# EAGLE design Lasers_Drivers_Design_Pingu_X1_pingu (EAGLE 9.6.2)
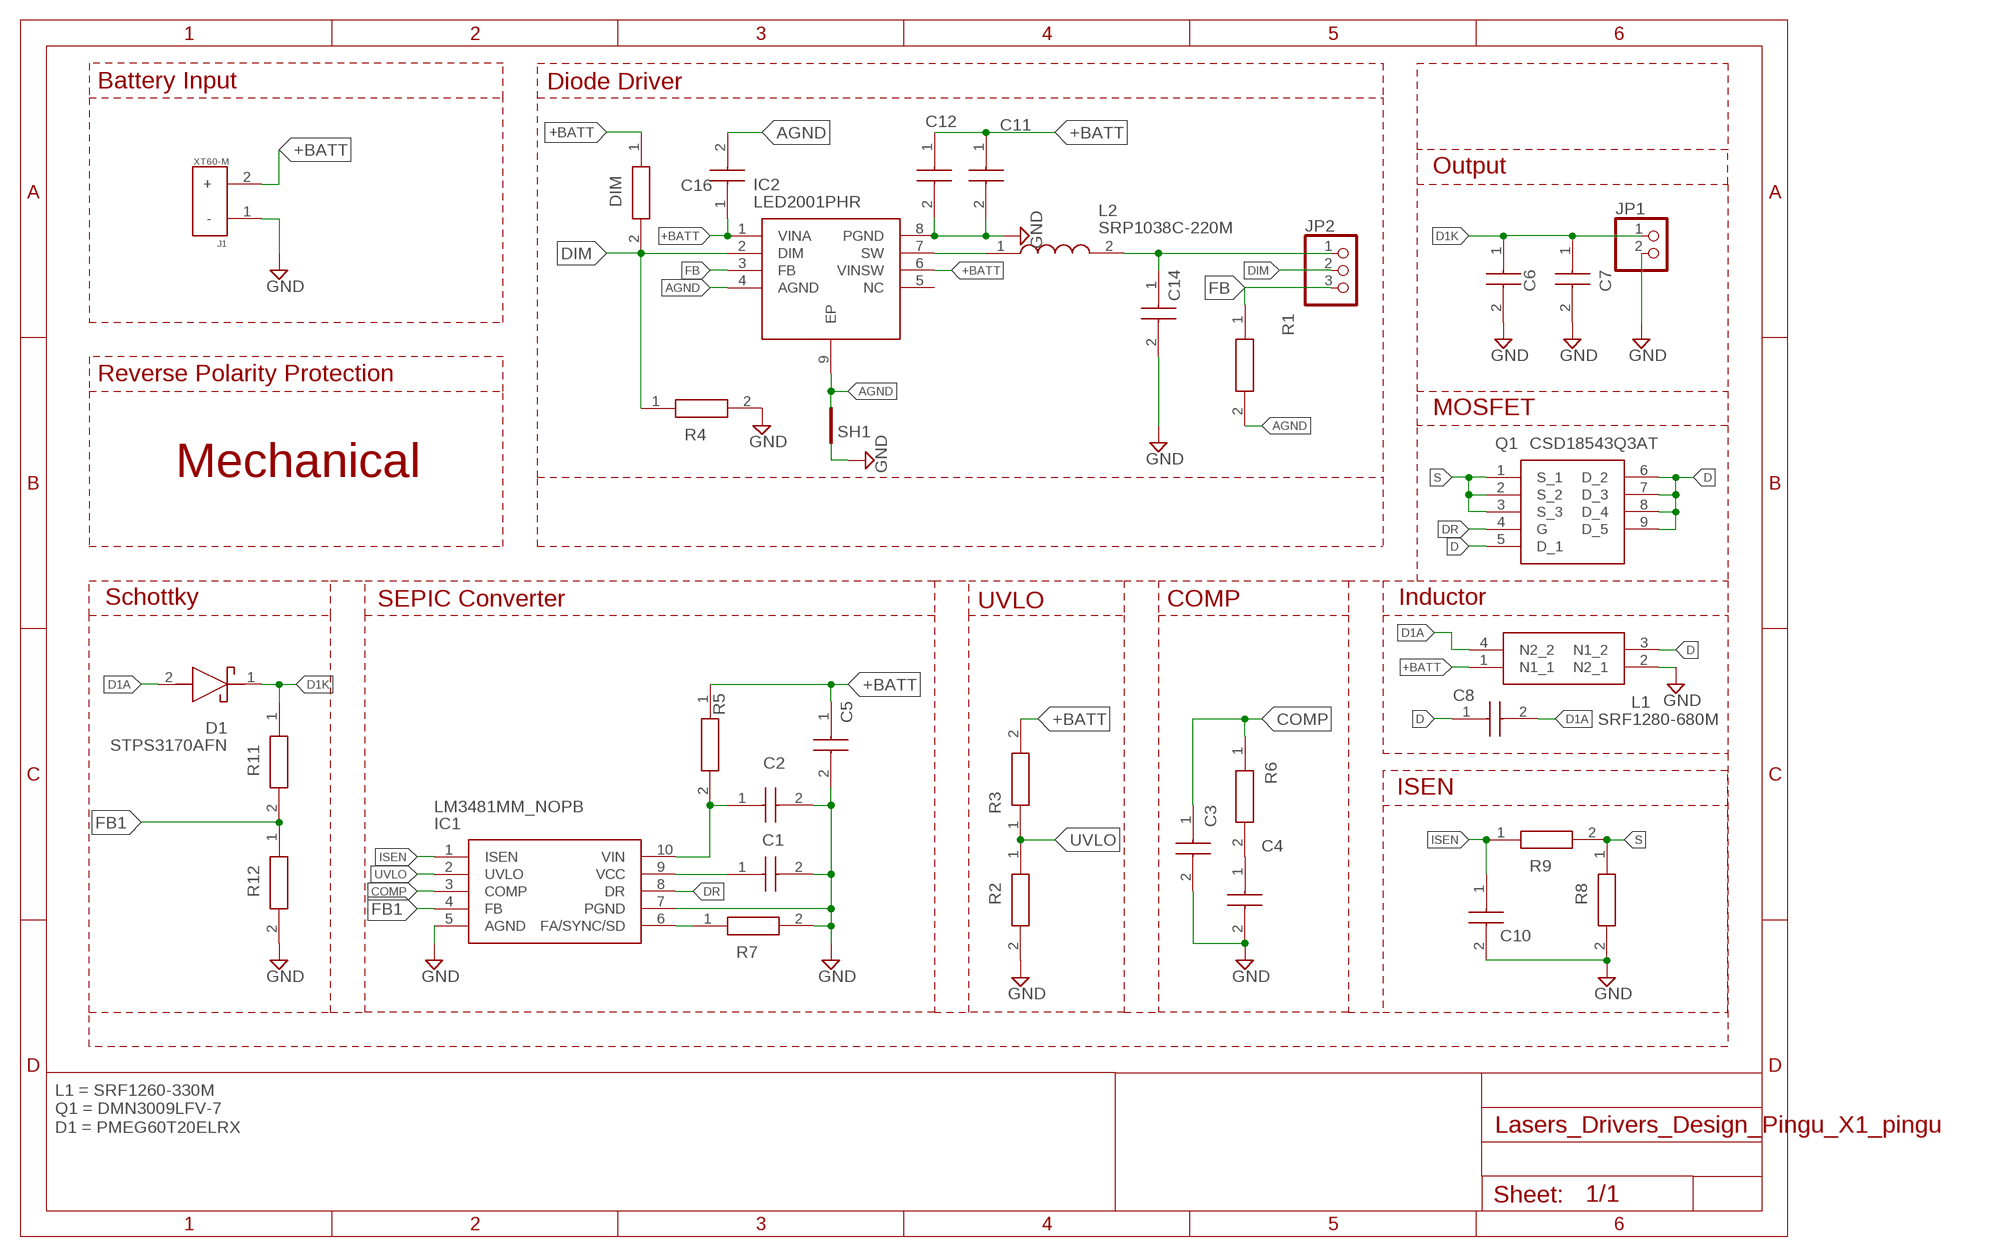
[diagram p0: schematic, sheet 1]

## Parts
C1  GCM0335C1H8R0DA16J  [CAPC0603X33N]
C2  GCM0335C1H8R0DA16J  [CAPC0603X33N]
C3  GCM0335C1H8R0DA16J  [CAPC0603X33N]
C4  GCM0335C1H8R0DA16J  [CAPC0603X33N]
C5  C1206C475K5RACTU  [CAPC3216X180N]
C6  C1206C475K5RACTU  [CAPC3216X180N]
C7  C1206C475K5RACTU  [CAPC3216X180N]
C8  C1206C475K5RACTU  [CAPC3216X180N]
C10  GCM0335C1H8R0DA16J  [CAPC0603X33N]
C11  GCM0335C1H8R0DA16J  [CAPC0603X33N]
C12  GCM0335C1H8R0DA16J  [CAPC0603X33N]
C14  C1206C475K5RACTU  [CAPC3216X180N]
C16  C1206C475K5RACTU  [CAPC3216X180N]
D1  STPS3170AFN  [SODFL5226X110N]
DIM  ERJ-3BWFR100V  [RESC1608X55N]
IC1  LM3481MM_NOPB  [SOP50P490X110-10N]
IC2  LED2001PHR  [SOIC127P600X170-9N]
J1  XT60-M  [AMASS_XT60-M]
JP1  PINHD-1X2  [1X02]
JP2  PINHD-1X3  [1X03]
L1  SRF1280-680M  [SRF1280680M]
L2  SRP1038C-220M  [INDPM110100X420N]
Q1  CSD18543Q3AT  [CSD18543Q3AT]
R1  ERJ-3BWFR100V  [RESC1608X55N]
R2  ERJ-3BWFR100V  [RESC1608X55N]
R3  ERJ-3BWFR100V  [RESC1608X55N]
R4  ERJ-3BWFR100V  [RESC1608X55N]
R5  ERJ-3BWFR100V  [RESC1608X55N]
R6  ERJ-3BWFR100V  [RESC1608X55N]
R7  ERJ-3BWFR100V  [RESC1608X55N]
R8  ERJ-3BWFR100V  [RESC1608X55N]
R9  ERJ-3BWFR100V  [RESC1608X55N]
R11  ERJ-3BWFR100V  [RESC1608X55N]
R12  ERJ-3BWFR100V  [RESC1608X55N]
SH1  SHORTT5  [SHORT_TOP-50]

## Nets
+BATT: C5.1 C11.1 C12.1 C16.1 DIM.1 IC2.1(VINA) IC2.6(VINSW) J1.2(+) L1.1(N1_1) R3.2 R5.1
AGND: C16.2 IC2.4(AGND) IC2.9(EP) R1.2 SH1.2
COMP: C3.1 IC1.3(COMP) R6.1
D: C8.1 L1.3(N1_2) Q1.5(D_1) Q1.6(D_2) Q1.7(D_3) Q1.8(D_4) Q1.9(D_5)
D1A: C8.2 D1.2(A) L1.4(N2_2)
D1K: C6.1 C7.1 D1.1(K) JP1.1 R11.1
DIM: DIM.2 IC2.2(DIM) JP2.2 R4.1
DR: IC1.8(DR) Q1.4(G)
FB: IC2.3(FB) JP2.3 R1.1
FB1: IC1.4(FB) R11.2 R12.1
GND: C1.2 C2.2 C3.2 C4.2 C5.2 C6.2 C7.2 C10.2 C11.2 C12.2 C14.2 IC1.5(AGND) IC1.7(PGND) IC2.8(PGND) J1.1(-) JP1.2 L1.2(N2_1) R2.2 R4.2 R7.2 R8.2 R12.2 SH1.1
ISEN: C10.1 IC1.1(ISEN) R9.1
N$1: C1.1 IC1.9(VCC)
N$2: C4.1 R6.2
N$7: IC2.7(SW) L2.1
N$8: IC1.6(FA/SYNC/SD) R7.1
N$9: C2.1 IC1.10(VIN) R5.2
N$10: C14.1 JP2.1 L2.2
S: Q1.1(S_1) Q1.2(S_2) Q1.3(S_3) R8.1 R9.2
UVLO: IC1.2(UVLO) R2.1 R3.1
Unconnected: IC2.5(NC)

## Notes on the sheet
- Battery Input | Diode Driver
- Output
- Reverse Polarity Protection
- MOSFET
- Mechanical
- Schottky | SEPIC Converter | UVLO | COMP | Inductor
- ISEN
- D1 = PMEG60T20ELRX
- L1 = SRF1260-330M | Q1 = DMN3009LFV-7

## Library data of the parts
C1-C4 C10-C12 = SamacSys_Parts:GCM0335C1H8R0DA16J: Capacitor GCM03 L=0.6mm W=0.3mm T=0.3mm Source: Datasheet <https://psearch.en.murata.com/capacitor/product/GCM0335C1H8R0DA16#.html>; ARROW_PART_NUMBER: GCM0335C1H8R0DA16J; DESCRIPTION: Capacitor GCM03 L=0.6mm W=0.3mm T=0.3mm; HEIGHT: 0.33mm; MANUFACTURER_NAME: Murata Electronics; MANUFACTURER_PART_NUMBER: GCM0335C1H8R0DA16J; MOUSER_PART_NUMBER: 81-GCM0335C1H8R0DA6J; MOUSER_PRICE-STOCK: https://www.mouser.co.uk/ProductDetail/Murata-Electronics/GCM0335C1H8R0DA16J?qs=5aG0NVq1C4xZsh9jmVEFyg%3D%3D
C5-C8 C14 C16 = SamacSys_Parts:C1206C475K5RACTU: Kemet 1206 C 4.7uF Ceramic Multilayer Capacitor, 50 V dc, +125C, X7R Dielectric, +/-10% Source: Datasheet <https://search.kemet.com/component-edge/download/specsheet/C1206C475K5RACTU.pdf>; ARROW_PART_NUMBER: C1206C475K5RACTU; ARROW_PRICE-STOCK: https://www.arrow.com/en/products/c1206c475k5ractu/kemet-corporation; DESCRIPTION: Kemet 1206 C 4.7uF Ceramic Multilayer Capacitor, 50 V dc, +125C, X7R Dielectric, +/-10%; HEIGHT: 1.8mm; MANUFACTURER_NAME: Kemet; MANUFACTURER_PART_NUMBER: C1206C475K5RACTU; MOUSER_PART_NUMBER: 80-C1206C475K5R; MOUSER_PRICE-STOCK: https://www.mouser.co.uk/ProductDetail/KEMET/C1206C475K5RACTU?qs=eTOzTKnOMhYOc4dq0S20Rg%3D%3D
D1 = SamacSys_Parts:STPS3170AFN: Schottky Diodes & Rectifiers DFD THYR TRIAC & RECTIFIER Source: Datasheet <https://www.st.com/resource/en/datasheet/stps3170.pdf>; ARROW_PART_NUMBER: STPS3170AFN; DESCRIPTION: Schottky Diodes & Rectifiers DFD THYR TRIAC & RECTIFIER; HEIGHT: 1.1mm; MANUFACTURER_NAME: STMicroelectronics; MANUFACTURER_PART_NUMBER: STPS3170AFN; MOUSER_PART_NUMBER: 511-STPS3170AFN; MOUSER_PRICE-STOCK: https://www.mouser.co.uk/ProductDetail/STMicroelectronics/STPS3170AFN?qs=Cb2nCFKsA8pM4tLC7PCfCQ%3D%3D
DIM R1-R9 R11 R12 = SamacSys_Parts:ERJ-3BWFR100V: Panasonic ERJ3B Series Thick Film Fixed Resistor 0603 Case 100m +/-1% 0.25W +/-150ppm/C Source: Datasheet <http://docs-emea.rs-online.com/webdocs/13ba/0900766b813ba21b.pdf>; ARROW_PART_NUMBER: ERJ-3BWFR100V; ARROW_PRICE-STOCK: https://www.arrow.com/en/products/erj3bwfr100v/panasonic; DESCRIPTION: Panasonic ERJ3B Series Thick Film Fixed Resistor 0603 Case 100m +/-1% 0.25W +/-150ppm/C; HEIGHT: 0.55mm; MANUFACTURER_NAME: Panasonic; MANUFACTURER_PART_NUMBER: ERJ-3BWFR100V; MOUSER_PART_NUMBER: 667-ERJ-3BWFR100V; MOUSER_PRICE-STOCK: https://www.mouser.co.uk/ProductDetail/Panasonic/ERJ-3BWFR100V?qs=ob%252BdNz2%252BYEjAMRvh2K5PaA%3D%3D
IC1 = SamacSys_Parts:LM3481MM_NOPB: Texas Instruments,LM3481MM/NOPB,IC,DC-DC Texas Instruments LM3481MM/NOPB, DC-DC Controller, 1A, 48 V, Step Up, 1 MHz, 10-Pin, VSSOP Source: Datasheet <http://www.ti.com/general/docs/lit/getliterature.tsp?genericPartNumber=lm3481&fileType=pdf>; ARROW_PART_NUMBER: LM3481MM/NOPB; ARROW_PRICE-STOCK: https://www.arrow.com/en/products/lm3481mmnopb/texas-instruments; DESCRIPTION: Texas Instruments,LM3481MM/NOPB,IC,DC-DC Texas Instruments LM3481MM/NOPB, DC-DC Controller, 1A, 48 V, Step Up, 1 MHz, 10-Pin, VSSOP; HEIGHT: 1.1mm; MANUFACTURER_NAME: Texas Instruments; MANUFACTURER_PART_NUMBER: LM3481MM/NOPB; MOUSER_PART_NUMBER: 926-LM3481MM/NOPB; MOUSER_PRICE-STOCK: https://www.mouser.co.uk/ProductDetail/Texas-Instruments/LM3481MM-NOPB?qs=X1J7HmVL2ZG0WJGe0ncCZw%3D%3D
IC2 = SamacSys_Parts:LED2001PHR: LED2001PHR, DC-DC Converter, 4A Adjustable, -1 18 V, Step Down, 1 MHz, 8-Pin HSOP Source: Datasheet <http://www.st.com/web/en/resource/technical/document/datasheet/DM00079085.pdf>; ARROW_PART_NUMBER: LED2001PHR; ARROW_PRICE-STOCK: https://www.arrow.com/en/products/led2001phr/stmicroelectronics; DESCRIPTION: LED2001PHR, DC-DC Converter, 4A Adjustable, -1 18 V, Step Down, 1 MHz, 8-Pin HSOP; HEIGHT: 1.7mm; MANUFACTURER_NAME: STMicroelectronics; MANUFACTURER_PART_NUMBER: LED2001PHR; MOUSER_PART_NUMBER: 511-LED2001PHR; MOUSER_PRICE-STOCK: https://www.mouser.co.uk/ProductDetail/STMicroelectronics/LED2001PHR?qs=WHlX%252B%252B9%2FRwCzdGFG7EvhjQ%3D%3D
J1 = XT60-M:XT60-M: DC supply; XT60; male; PIN:2; for cable; soldered; 60A; 500V; AVAILABILITY: Unavailable; DESCRIPTION: Plug; DC supply; XT60; male; PIN: 2; for cable; soldered; 30A; 500V; MF: AMASS; MP: XT60-M; PACKAGE: Package; PRICE: None
JP1 = pinhead:PINHD-1X2: PIN HEADER
JP2 = pinhead:PINHD-1X3: PIN HEADER
L1 = SamacSys_Parts:SRF1280-680M: SRF1280 Series - Dual-Winding Shielded Power Inductors Source: Datasheet <https://componentsearchengine.com/Datasheets/2/SRF1280-680M.pdf>; ARROW_PART_NUMBER: SRF1280-680M; ARROW_PRICE-STOCK: https://www.arrow.com/en/products/srf1280-680m/bourns; DESCRIPTION: SRF1280 Series - Dual-Winding Shielded Power Inductors; HEIGHT: 8mm; MANUFACTURER_NAME: Bourns; MANUFACTURER_PART_NUMBER: SRF1280-680M; MOUSER_PART_NUMBER: 652-SRF1280-680M; MOUSER_PRICE-STOCK: https://www.mouser.co.uk/ProductDetail/Bourns/SRF1280-680M?qs=Q2Pzc27CV9vH3OhKUPbroQ%3D%3D; SPICEPREFIX: E
L2 = SamacSys_Parts:SRP1038C-220M: Fixed Inductors Ind,11x10x3.8mm,22uH 20%,5.2A,Shd,SMD Source: Datasheet <https://www.arrow.com/en/products/srp1038c-220m/bourns>; ARROW_PART_NUMBER: SRP1038C-220M; ARROW_PRICE-STOCK: https://www.arrow.com/en/products/srp1038c-220m/bourns; DESCRIPTION: Fixed Inductors Ind,11x10x3.8mm,22uH 20%,5.2A,Shd,SMD; HEIGHT: 4.2mm; MANUFACTURER_NAME: Bourns; MANUFACTURER_PART_NUMBER: SRP1038C-220M; MOUSER_PART_NUMBER: 652-SRP1038C-220M; MOUSER_PRICE-STOCK: https://www.mouser.co.uk/ProductDetail/Bourns/SRP1038C-220M?qs=PzGy0jfpSMsbn3qGixQNTg%3D%3D
Q1 = SamacSys_Parts:CSD18543Q3AT: 60V, N ch NexFET MOSFET, single SON3x3, 9.9mOhm Source: Datasheet <http://www.ti.com/lit/gpn/csd18543q3a>; ARROW_PART_NUMBER: CSD18543Q3AT; ARROW_PRICE-STOCK: https://www.arrow.com/en/products/csd18543q3at/texas-instruments; DESCRIPTION: 60V, N ch NexFET MOSFET, single SON3x3, 9.9mOhm; HEIGHT: 0.9mm; MANUFACTURER_NAME: Texas Instruments; MANUFACTURER_PART_NUMBER: CSD18543Q3AT; MOUSER_PART_NUMBER: 595-CSD18543Q3AT; MOUSER_PRICE-STOCK: https://www.mouser.co.uk/ProductDetail/Texas-Instruments/CSD18543Q3AT?qs=34RfhUjJmKepUVbl57nHwQ%3D%3D
SH1 = shorts:SHORT: Short between two nets; BOM: no

## Board
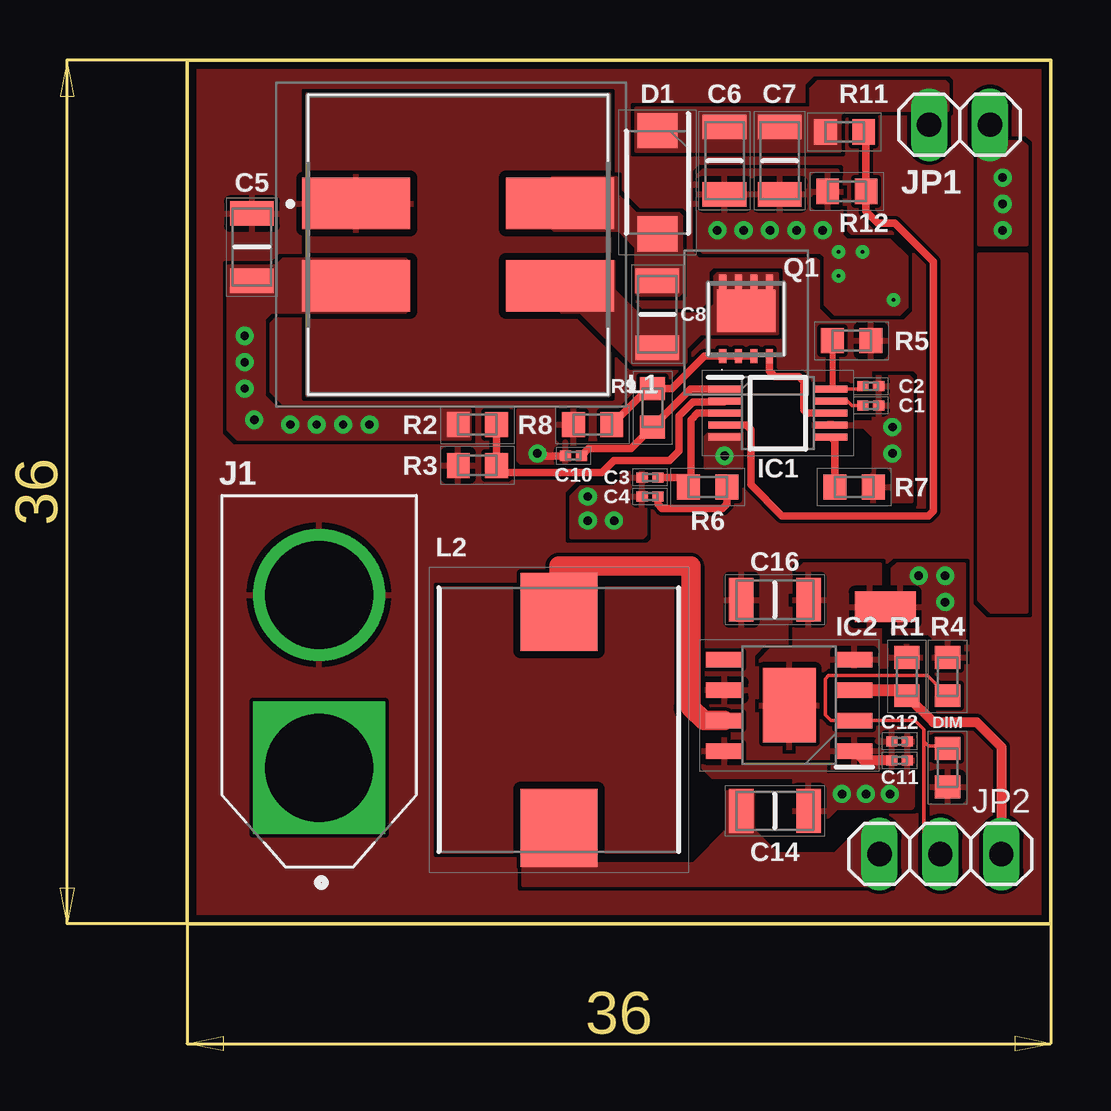
[diagram p1: board, top side]
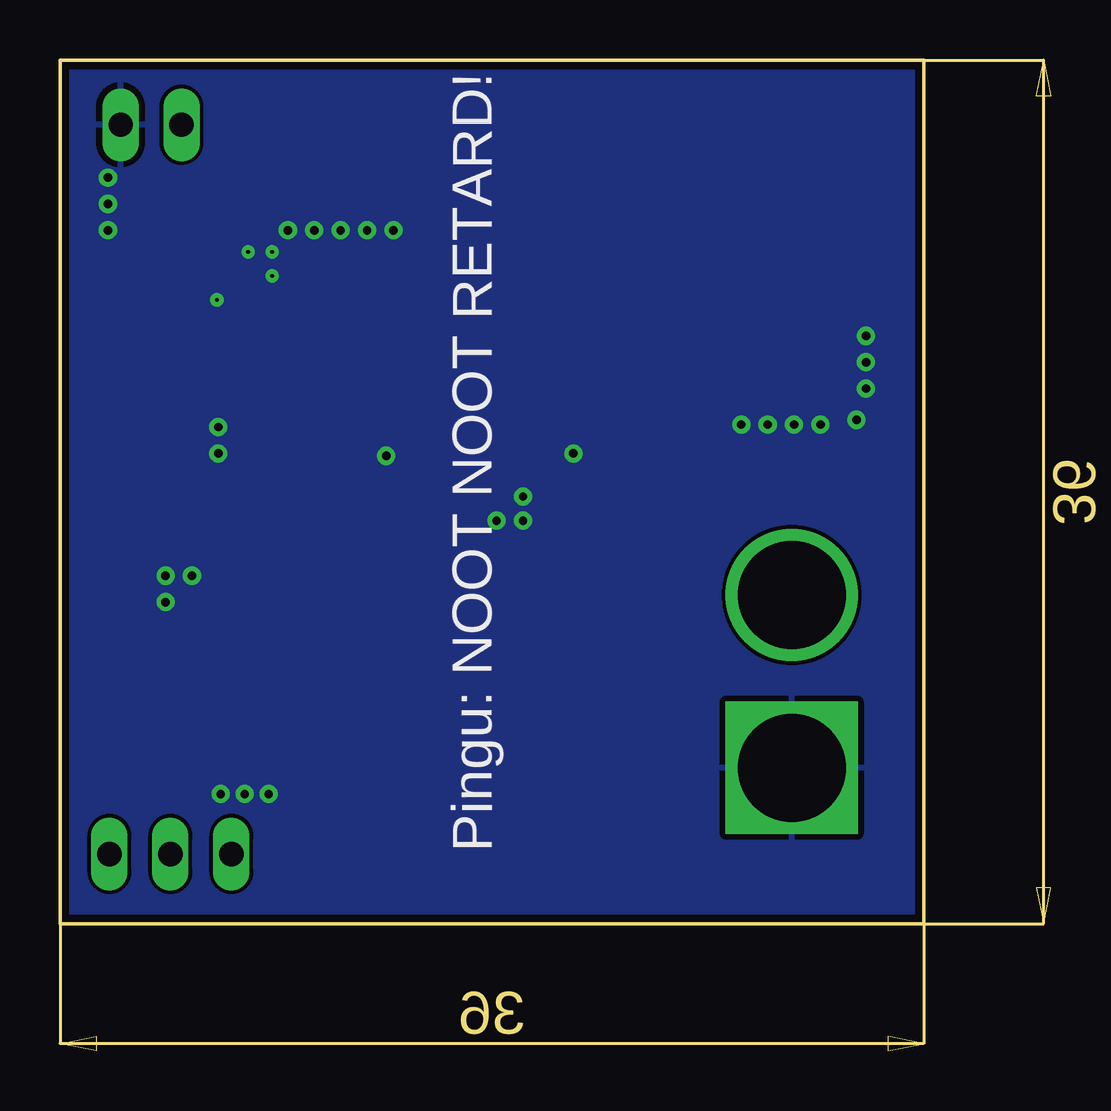
[diagram p2: board, bottom side, seen from below]

Size 36 x 36 mm. Coordinates in mm from the lower left corner, seen from the top.
Outline: 0,0 36,0 36,36 0,36 0,0
Copper layers (1*16): Top 0.035mm / dielectric 1.5mm / Bottom 0.035mm
Design rules "default *": minimum track width 6mil, minimum drill 0.15mm, track to track 6mil, track to pad 6mil, pad to pad 6mil, via to via 6mil, smd to smd 6mil, copper to edge 0.3mm, drill to drill 6mil, minimum pad ring 10mil, minimum via ring 8mil, stop-mask expansion 4mil, vias tented up to drill 0mil, thermal gap 10mil

### Footprints (pad centres in the part's own frame; a part is rotated, then mirrored left to right if it is on the bottom)
CAPC0603X33N = smd 0.46 x 0.42: 1 -0.33,0; 2 0.33,0
CAPC3216X180N = smd 1.02 x 1.82: 1 -1.4,0; 2 1.4,0
SODFL5226X110N = smd 1.46 x 1.67: 1 -2.15,0; 2 2.15,0
RESC1608X55N = smd 0.95 x 1.05: 1 -0.8,0; 2 0.8,0
SOP50P490X110-10N = smd 1.4 x 0.3: 1 -2.2,1; 2 -2.2,0.5; 3 -2.2,0; 4 -2.2,-0.5; 5 -2.2,-1; 6 2.2,-1; 7 2.2,-0.5; 8 2.2,0; 9 2.2,0.5; 10 2.2,1
SOIC127P600X170-9N = smd 1.525 x 0.65: 1 -2.712,1.905; 2 -2.712,0.635; 3 -2.712,-0.635; 4 -2.712,-1.905; 5 2.712,-1.905; 6 2.712,-0.635; 7 2.712,0.635; 8 2.712,1.905 | smd 2.2 x 3.1: 9 0,0
AMASS_XT60-M = drill 4.5 square: 1 -3.6,0 | drill 4.5: 2 3.6,0
1X02 = drill 1.016 long: 1 -1.27,0; 2 1.27,0
1X03 = drill 1.016 long: 1 -2.54,0; 2 0,0; 3 2.54,0
SRF1280680M = smd 2.15 x 4.5: 1 1.715,4.25; 2 -1.715,4.25; 3 -1.715,-4.25; 4 1.715,-4.25
INDPM110100X420N = smd 3.25 x 3.2: 1 -4.5,0; 2 4.5,0
CSD18543Q3AT = smd 0.6 x 0.3: 1 -1.243,0.975; 2 -1.243,0.325; 3 -1.243,-0.325; 4 -1.243,-0.975 | smd 0.635 x 0.3: 5 1.839,-0.975; 6 1.839,-0.325; 7 1.839,0.325; 8 1.839,0.975 | smd 1.775 x 2.45: 9 0.634,0
SHORT_TOP-50 = smd 1.27 x 1.27: 1 0.635,0; 2 -0.635,0

### Placement (x,y rotation side)
C1  28.5,21.6 0 top
C2  28.5,22.4 0 top
C3  19.3,18.6 180 top
C4  19.3,17.8 180 top
C5  2.7,28.2 270 top
C6  22.4,31.8 270 top
C7  24.7,31.8 270 top
C8  19.6,25.4 90 top
C10  16.1,19.5 180 top
C11  29.7,6.8 0 top
C12  29.7,7.6 0 top
C14  24.5,4.7 0 top
C16  24.5,13.5 0 top
D1  19.6,30.9 270 top
DIM  31.7,6.5 90 top
IC1  24.63,21.28 0 top
IC2  25.1,9.1 180 top
J1  5.5,10.1 90 top
JP1  32.2,33.3 0 top
JP2  31.4,2.9 0 top
L1  11.3,28.3 90 top
L2  15.5,8.5 270 top
Q1  23.3,24.9 90 top
R1  30,10.3 90 top
R2  12.1,20.8 180 top
R3  12.1,19.1 180 top
R4  31.7,10.3 90 top
R5  27.7,24.3 180 top
R6  21.7,18.2 0 top
R7  27.8,18.2 0 top
R8  16.9,20.8 180 top
R9  19.4,21.5 90 top
R11  27.4,33 0 top
R12  27.5,30.52 180 top
SH1  29.1,13.2 0 top

### Tracks (layer width: path | path; a pad name or v marks a point on that pad's centre or on a via)
+BATT
  Top 0.406: C11.1 28.21,6.8 IC2.1
  pour Top (rank 2): 0,0 36,0 36,36 0,36
AGND
  pour Top: 25.7,15 25.3,14.6 25.3,11.4 24.3,11.4 23.9,11 23.9,7.4 24,7.3 26.1,7.3 26.3,7.5 26.3,10.3 26.7,10.7 28.9,10.7 28.9,15
  pour Top: 27,10.7 30.6,10.7 30.6,11.6 27,11.6
COMP
  Top 0.305: IC1.3 21.28,21.28 21,21 21,18.6 | C3.1 21,18.6 | R6.1 20.9,18.5 21,18.6
CUT
  pour Top (isolate 0.305): 10.5,14 10.5,3 13.6,3 13.6,5.7 13.8,5.9 17.2,5.9 17.4,5.7 17.4,3 20.5,3 20.5,14 17.3,14 17.3,11.2 13.7,11.2 13.7,14
  pour Top (isolate 0.305): 5,31.4 5,34.6 17.6,34.6 17.6,31.4 13.2,31.4 13.1,31.3 13.1,28.8 13.3,28.6 17.6,28.6 17.6,27.9 13.2,27.9 13.1,27.8 13.1,25.4 13.3,25.2 16.2,25.2 17.6,23.8 17.6,22 5,22 5,25.2 9.4,25.2 9.5,25.3 9.5,27.8 9.3,28 5,28 5,28.7 9.5,28.7 9.6,28.8 9.6,31.2 9.4,31.4
D
  pour Top (no thermals): 18.6,25.2 18.6,23.3 20.7,23.3 20.8,23.4 20.8,24 21.4,24.6 24.6,24.6 24.6,27.1 22.1,27.1 22,27 22,25.8 21.6,25.4 18.8,25.4
  pour Top (no thermals): 15.6,27.6 15.6,25.5 16.4,25.5 18.6,23.3 20.7,23.3 20.8,23.4 20.8,25.4 18.8,25.4 17.8,26.4 17.8,27.6
D1A
  pour Top (no thermals): 15.2,31.1 15.2,29 15.3,28.9 18,28.9 18.7,28.2 18.7,26.3 18.8,26.2 20.5,26.2 20.6,26.3 20.6,29.5 20.5,29.6 18.7,29.6 17.9,30.4 17.9,31.1
D1K
  pour Top (no thermals): 18.7,34 18.7,32.2 27.2,32.2 27.2,34
  pour Top (no thermals): 26,33.4 26,34.8 26.3,35.1 31.6,35.1 31.7,35 31.7,33.9 27.4,33.9 27.1,33.6 27.1,33.4 27,33.3 26.1,33.3
DIM
  Top 0.152: DIM.2 31.6,7.4 30.9,7.4 30.7,7.6 | 30.7,7.6 30.7,8.1 30.34,8.46 IC2.2 26.84,8.46 26.6,8.7 26.6,10.2 26.74,10.34 30.86,10.34 R4.1 | JP2.2 30.7,3.6 30.7,7.6
DR
  Top 0.305: Q1.4 24.27,23.02 24.5,22.8 25.5,22.8 25.7,22.6 25.7,21.4 25.82,21.28 IC1.8
FB
  Top 0.406: R1.1 31.1,8.4 32.9,8.4 33.94,7.36 JP2.3
  Top 0.508: IC2.3 29.77,9.73 R1.1
FB1
  Top 0.305: IC1.4 23.32,20.78 23.5,20.6 23.5,18.3 24.8,17 30.9,17 31.1,17.2 31.1,27.6 29.5,29.2 28.8,29.2 28.3,29.7 R12.1 28.3,32.9 R11.2
GND  (via drill 0.15 pad 0.5, 0.35, 0.35 pad 0.5)
  Top 0.305: C10.2 14.7,19.5 v14.6,19.6
  other vias: 27.3,5.4 28.3,5.4 29.3,5.4 30.5,14.5 31.6,14.5 29.4,20.7 29.4,19.6 2.4,24.5 2.4,23.4 2.4,22.3 2.8,21 4.3,20.8 5.4,20.8 6.5,20.8 7.6,20.8 22.4,19.5 22.1,28.9 23.2,28.9 24.3,28.9 25.4,28.9 26.5,28.9 16.7,17.8 17.8,16.8 16.7,16.8 31.6,13.4 34,31.1 34,30 34,28.9 27.15,28 28.15,28 27.15,27 29.45,26
  pour Bottom (rank 2): 0,0 36,0 36,36 0,36
  pour Top: 29.8,7.9 29.8,6.4 29.6,6.2 25.4,6.2 25.3,6.1 25.3,4.2 26.5,4.2 27.1,4.8 30.2,4.8 30.3,4.9 30.3,7.9
  pour Top: 21.5,7.7 22.9,7.7 22.9,6.6 26.6,6.6 26.6,4.1 26.5,4 25.5,4 25.3,4.2 25.3,6.1 21.9,6.1 21.5,6.5
  pour Top: 28.6,22.7 28.6,18.8 28.5,18.7 28.2,18.7 28.2,17.6 30.2,17.6 30.2,22.7 30.1,22.8 28.7,22.8
  pour Top (no thermals): 11.8,21.4 11.8,20.2 2.1,20.2 1.7,20.6 1.7,27.4 3.7,27.4 4,27.7 9.1,27.7 9.2,27.6 9.2,25.6 9.1,25.5 3.5,25.5 3.2,25.2 3.2,22 3.8,21.4
  pour Top (no thermals): 33,28.3 33,31.9 33.7,32.6 34.8,32.6 35,32.4 35,28.3
  pour Top (no thermals): 23.2,20.4 21.7,20.4 21.6,20.3 21.6,19 23.1,19 23.2,19.1
  pour Top: 19.1,18.8 19.1,16.2 19,16.1 16,16.1 16,17.8 16.4,18.2 17.8,18.2 18.1,18.5 18.1,18.8
  pour Top: 16.5,21.3 16.5,20.3 16.2,20 16,20 15.9,19.9 15.9,19.3 15.8,19.2 13.9,19.2 13.8,19.3 13.8,21.4 16.4,21.4
  pour Top: 26.1,20.7 28.2,20.7 28.6,20.3 28.9,20.3 28.9,20.8 28.8,20.9 26.1,20.9
  pour Top: 21.3,31.2 21.3,28.2 21.5,28 26.4,28 26.6,27.8 26.6,25.8 27,25.4 29.7,25.4 30,25.7 30,27.8 29.3,28.5 27.5,28.5 27.3,28.7 27.3,31.2 27.1,31.4 21.5,31.4
  pour Top: 31.1,11.9 31.1,10.7 32.4,10.7 32.4,15 29.6,15 29.4,14.8 29.4,12.1 30.9,12.1
ISEN
  Top 0.305: IC1.1 20.99,22.28 R9.1 18.5,19.8 16.73,19.8 C10.1
LOGO
  pour Top: 33,27.9 33,13.5 33.5,13 35,13 35,27.9
N$1
  Top 0.152: IC1.9 27.52,21.78 27.7,21.6 C1.1
N$2
  Top 0.305: C4.1 19.63,17.48 19.8,17.31 22.31,17.31 22.5,17.5 R6.2
N$7
  Top 0.813: L2.1 15.5,14.9 21,14.9 21,9 21.54,8.46 IC2.7
N$8
  Top 0.305: R7.1 27,20.11 IC1.6
N$9
  Top 0.152: C2.1 28.05,22.28 26.9,22.28 IC1.10
  Top 0.254: R5.2 26.9,22.28
N$10
  pour Top (no thermals): 14,5.4 14,1.6 29.3,1.6 29.3,3.8 29,4.1 28.2,4.1 27,2.9 24.6,2.9 23.6,3.9 23.6,5.5 22.5,5.5 22.5,3.9 21.1,2.5 17,2.5 17,5.4
S
  Top 0.305: Q1.3 Q1.2 Q1.1 21.56,23.66 20.2,22.3 R9.2 19.2,22.3 R8.1
UVLO
  Top 0.305: IC1.2 22.39,21.74 21.09,21.74 20.5,21.15 20.5,19.7 20.1,19.3 17.8,19.3 17.3,18.8 13.2,18.8 R3.1 R2.1

### Text on the board
bNames: Pingu: NOOT NOOT RETARD!